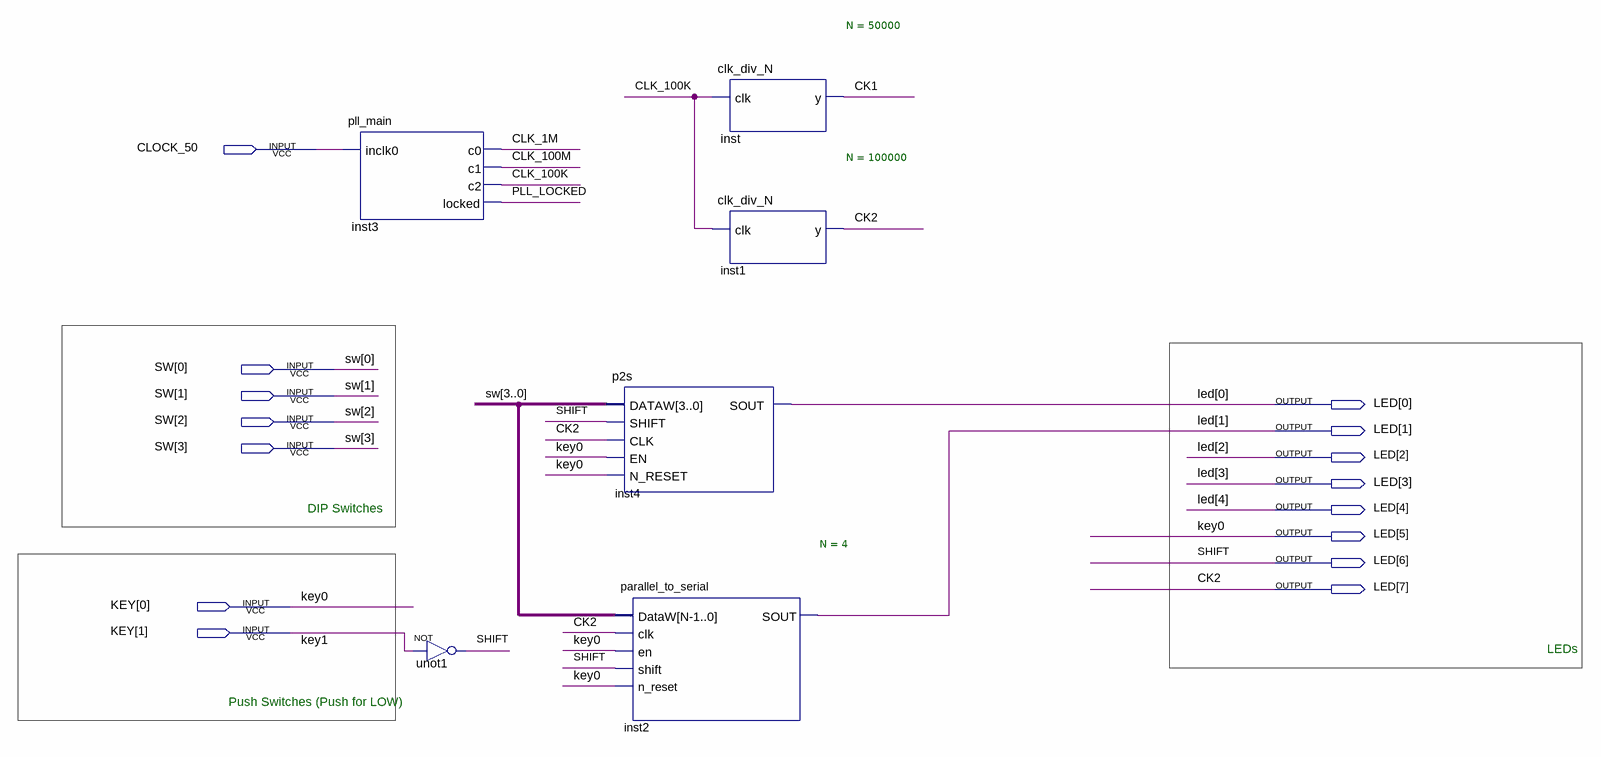
[diagram p0: schematic sheet]
// Quartus schematic TopLevelSchematic.bdf as structural Verilog: 6 symbols, 15 pins
module TopLevelSchematic (
  input  CLOCK_50,
  input  [3:0] SW,
  input  [1:0] KEY,
  output [7:0] LED
);

  wire CK1, CLK_1M, CLK_100K, CLK_100M, PLL_LOCKED;

  pll_main inst3 (.inclk0(CLOCK_50), .c0(CLK_1M), .c1(CLK_100M), .c2(CLK_100K), .locked(PLL_LOCKED));
  not unot1 (LED[6], KEY[1]);
  p2s inst4 (.DATAW(SW), .SHIFT(LED[6]), .CLK(LED[7]), .EN(KEY[0]), .N_RESET(KEY[0]), .SOUT(LED[0]));
  parallel_to_serial #(.N(4)) inst2 (
    .DataW(SW), .clk(LED[7]), .en(KEY[0]), .shift(LED[6]), .n_reset(KEY[0]), .SOUT(LED[1]));
  clk_div_N #(.N(50000)) inst (.clk(CLK_100K), .y(CK1));
  clk_div_N #(.N(100000)) inst1 (.clk(CLK_100K), .y(LED[7]));

  assign LED[5] = KEY[0];

  // Other names for the same wires on the sheet: CK2 = LED[7]; SHIFT = LED[6]

  // Notes on the sheet:
  //   DIP Switches
  //   LEDs
  //   Push Switches (Push for LOW)
endmodule
